# EAGLE schematic Controller (EAGLE 6.2)
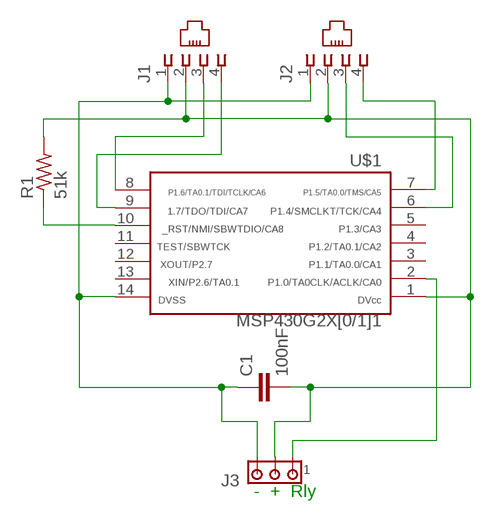
[diagram p0: schematic, sheet 1]

## Parts
C1  100nF  C2.5/2  [C2.5-2]
J1  555166-3  [555166-3]
J2  555166-3  [555166-3]
J3  MTA03-100  [10X03MTA]
R1  51k  R-US_R0603  [R0603]
U$1  G2X[0/1]1---N14  [N14]

## Nets
N$1: C1.1 J1.1 J2.1 J3.3 U$1.14
N$2: C1.2 J1.2 J2.2 J3.2 R1.2 U$1.1
N$3: R1.1 U$1.10
N$4: J1.3 U$1.8
N$5: J1.4 U$1.9
N$6: J3.1 U$1.2
N$7: J2.4 U$1.7
N$8: J2.3 U$1.6
Unconnected: U$1.3 U$1.4 U$1.5 U$1.11 U$1.12 U$1.13

## Notes on the sheet
- -  +  Rly

## Library data of the parts
C1 = capacitor-wima:C: CAPACITOR naming: grid - package width
J1 J2 = con-amp:555166-3: AMP connector
J3 = con-amp:MTA03-100: AMP connector
R1 = resistor:R-US_: RESISTOR, American symbol
U$1 = TI_MSP430_v16:G2X[0/1]1---N14: MSP430G2X[0/1]1 MSP430G2001, MSP430G2101, MSP430G2201,MSP430G2111, G2211 PDIP (N) 14 Pin Package http://focus.ti.com/docs/prod/folders/print/msp430g2111.html